# Altium schematic sheet interface2.SchDoc
size A
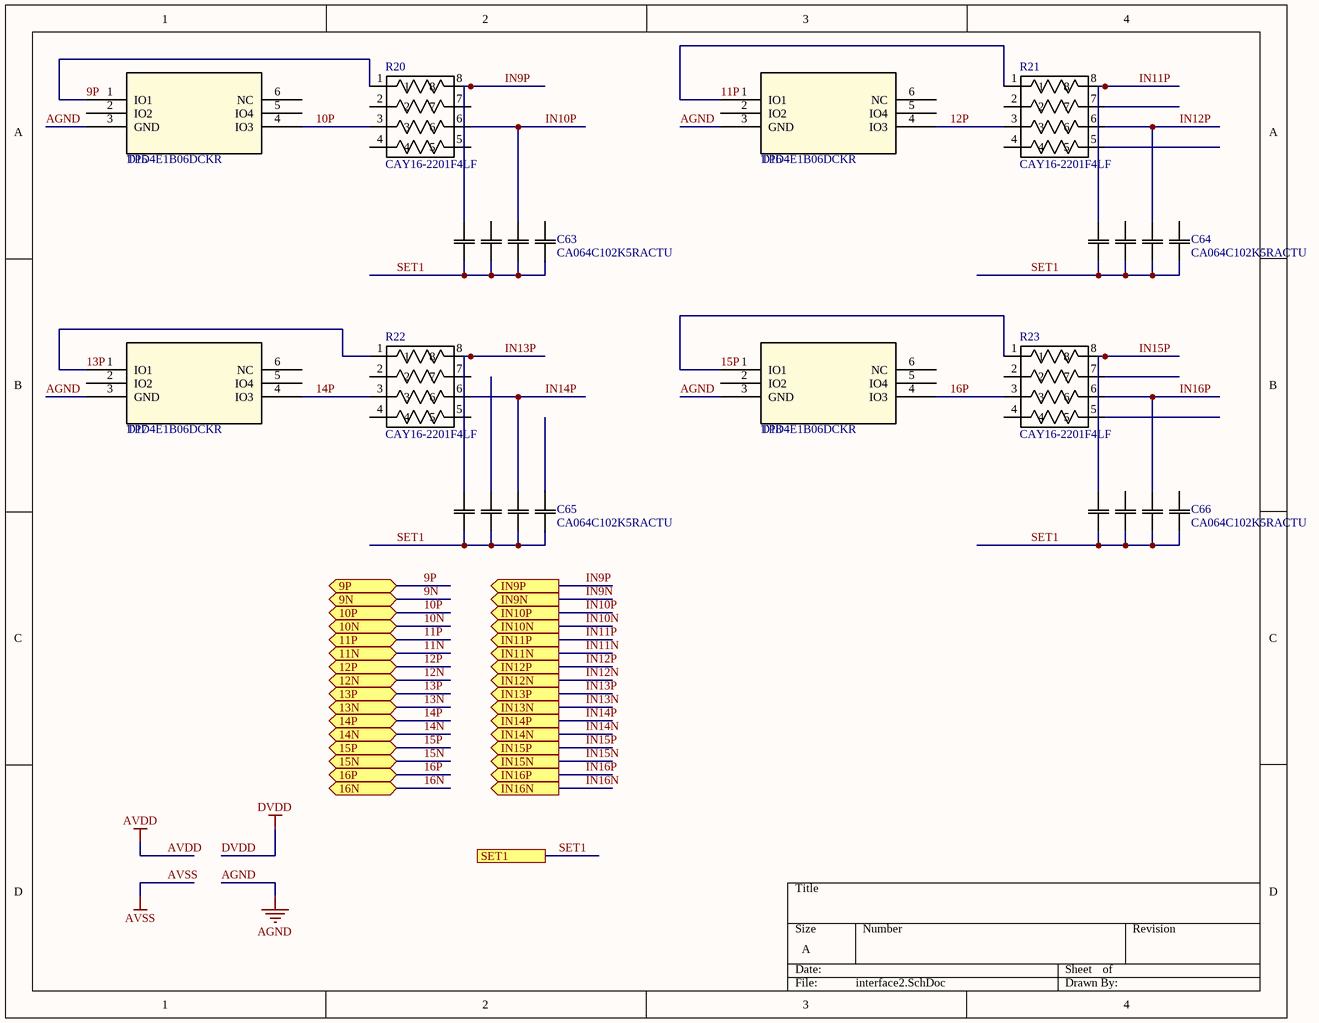
[diagram p0: interface2.SchDoc]

## Parts
C63  CA064C102K5RACTU  [CA064]
C64  CA064C102K5RACTU  [CA064]
C65  CA064C102K5RACTU  [CA064]
C66  CA064C102K5RACTU  [CA064]
D15  TPD4E1B06DCKR  [DCK6]
D16  TPD4E1B06DCKR  [DCK6]
D17  TPD4E1B06DCKR  [DCK6]
D18  TPD4E1B06DCKR  [DCK6]
R20  CAY16-2201F4LF  [*RESCAXE80P320X160-8N]
R21  CAY16-2201F4LF  [*RESCAXE80P320X160-8N]
R22  CAY16-2201F4LF  [*RESCAXE80P320X160-8N]
R23  CAY16-2201F4LF  [*RESCAXE80P320X160-8N]

## Ports
9N (bidir), 9P (bidir), 10N (bidir), 10P (bidir), 11N (bidir), 11P (bidir), 12N (bidir), 12P (bidir), 13N (bidir), 13P (bidir), 14N (bidir), 14P (bidir), 15N (bidir), 15P (bidir), 16N (bidir), 16P (bidir), IN9N (out), IN9P (out), IN10N (out), IN10P (out), IN11N (out), IN11P (out), IN12N (out), IN12P (out), IN13N (out), IN13P (out), IN14N (out), IN14P (out), IN15N (out), IN15P (out), IN16N (out), IN16P (out), SET1

## Nets
AGND: D15.3(GND) D16.3(GND) D17.3(GND) D18.3(GND)
9N: port 9N
9P: D15.1(IO1) R20.1 ; port 9P
10N: port 10N
10P: D15.4(IO3) R20.3 ; port 10P
11N: port 11N
11P: D16.1(IO1) R21.1 ; port 11P
12N: port 12N
12P: D16.4(IO3) R21.3 ; port 12P
13N: port 13N
13P: D17.1(IO1) R22.1 ; port 13P
14N: port 14N
14P: D17.4(IO3) R22.3 ; port 14P
15N: port 15N
15P: D18.1(IO1) R23.1 ; port 15P
16N: port 16N
16P: D18.4(IO3) R23.3 ; port 16P
IN9N: port IN9N
IN9P: C63.8 R20.8 ; port IN9P
IN10N: port IN10N
IN10P: C63.6 R20.6 ; port IN10P
IN11N: port IN11N
IN11P: C64.8 R21.8 ; port IN11P
IN12N: port IN12N
IN12P: C64.6 R21.6 ; port IN12P
IN13N: port IN13N
IN13P: C65.8 R22.8 ; port IN13P
IN14N: port IN14N
IN14P: C65.6 R22.6 ; port IN14P
IN15N: port IN15N
IN15P: C66.8 R23.8 ; port IN15P
IN16N: port IN16N
IN16P: C66.6 R23.6 ; port IN16P
SET1: C63.1 C63.2 C63.3 C63.4 C64.1 C64.2 C64.3 C64.4 C65.1 C65.2 C65.3 C65.4 C66.1 C66.2 C66.3 C66.4 ; port SET1

Not connected (* = marked no-connect by the designer): C63 5 7; C64 5 7; C65 5 7; C66 5 7; D15 2(IO2) 5(IO4) 6(NC); D16 2(IO2) 5(IO4) 6(NC); D17 2(IO2) 5(IO4) 6(NC); D18 2(IO2) 5(IO4) 6(NC); R20 2 4 5 7; R21 2 4 5 7; R22 2 4 5 7; R23 2 4 5 7

## Library data of the parts
C63-C66 = CA064C102K5RACTU: CAP ARRAY 1000PF 50V X7R 0612; Manufacturer 1: KEMET; Dielectric Material: Ceramic; Capacitance: 1nF; Tolerance: 10%; Number of Capacitors: 4; Circuit Type: Isolated; Supplier 1: Digi-Key; Manufacturer Part Number 1: CA064C102K5RACTU; Stock 1: 12; Pricing 1: 1=0.61000, 10=0.42800, 100=0.28180, 500=0.20874, 1000=0.17743 (USD); RoHS: Yes; Mount: Surface Mount; Case/Package: 0612; Case Code (Metric): 1632; Case Code (Imperial): 0612; Contact Plating: Tin,Matte; Number of Terminals: 8; Min Operating Temperature: -55°C; Max Operating Temperature: 125°C; Packaging: Tape and Reel; Package Quantity: 4000; Voltage Rating: 50V; Dielectric: X7R; Termination: SMD/SMT; Number of Elements: 4; Voltage Rating (DC): 50V; Number of Circuits: 4; Length: 0.063inch; Height: 0.8mm; Width: 1.6mm; Height - Seated (Max): 0.035inch; Terminal Pitch: 0.8mm; REACH SVHC: No SVHC; Lead Free: Lead Free; ComponentLink1URL: http://www.farnell.com/datasheets/1868478.pdf?src-supplier=Farnell; ComponentLink1Description: http://www.farnell.com/datasheets/1868478.pdf?src-supplier=Farnell; ComponentLink2URL: https://media.digikey.com/pdf/Data%20Sheets/Kemet%20PDFs/X7R_Dielectric_10-200V_Rev_Nov2013.pdf?src-supplier=Digi-Key; ComponentLink2Description: https://media.digikey.com/pdf/Data%20Sheets/Kemet%20PDFs/X7R_Dielectric_10-200V_Rev_Nov2013.pdf?src-supplier=Digi-Key; ComponentLink3URL: http://www.mouser.com/ds/2/212/KEM_C1017_X7R_ARRAY_SMD-1102778.pdf?src-supplier=Mouser; ComponentLink3Description: http://www.mouser.com/ds/2/212/KEM_C1017_X7R_ARRAY_SMD-1102778.pdf?src-supplier=Mouser; ComponentLink4URL: http://www.farnell.com/datasheets/1868478.pdf?src-supplier=Element14; ComponentLink4Description: http://www.farnell.com/datasheets/1868478.pdf?src-supplier=Element14; ComponentLink5URL: http://capacitoredge.kemet.com/capedge2/DataSheet/Datasheet-CA064C102K5RACTU.pdf?pn=CA064C102K5RACTU&src-supplier=Avnet; ComponentLink5Description: http://capacitoredge.kemet.com/capedge2/DataSheet/Datasheet-CA064C102K5RACTU.pdf?pn=CA064C102K5RACTU&src-supplier=Avnet; ComponentLink6URL: http://capacitoredge.kemet.com/capedge2/DataSheet/Datasheet-CA064C102K5RACTU.pdf?pn=CA064C102K5RACTU&src-supplier=Avnet+Asia; ComponentLink6Description: http://capacitoredge.kemet.com/capedge2/DataSheet/Datasheet-CA064C102K5RACTU.pdf?pn=CA064C102K5RACTU&src-supplier=Avnet+Asia; Supplier Part Number 1: 399-9415-1-ND
D15-D18 = TPD4E1B06DCKR: TVS DIODE 5.5VWM 14.5VC SC70-6; Manufacturer 1: Texas Instruments; Capacitance: 1pF; Operating Supply Voltage: 5.5V; Direction: Bidirectional,Unidirectional; Number of Bidirectional Channels: 4; Min Breakdown Voltage: 7V; Clamping Voltage: 14.5V; Peak Pulse Power: 45W; Power Line Protection: No; Polarity: Bidirectional; ESD Protection: Yes; Max Reverse Leakage Current: 500pA; Test Current: 1mA; Peak Pulse Current: 3A; Interface: LVDS,USB; Supplier 1: Digi-Key; Manufacturer Part Number 1: TPD4E1B06DCKR; Stock 1: 27694; Pricing 1: 1=0.58000, 10=0.49400, 100=0.36920, 500=0.29004, 1000=0.22413 (USD); RoHS: Yes; Mount: Surface Mount; Case/Package: SC; Number of Pins: 6; Min Operating Temperature: -40°C; Max Operating Temperature: 125°C; Package Quantity: 3000; Packaging: Tape and Reel; Reverse Standoff Voltage: 5.5V; Breakdown Voltage: 7V; Number of Channels: 4; Termination: SMD/SMT; Working Voltage: 5.5V; Max Power Dissipation: 45W; Length: 2.15mm; Height: 1mm; Width: 1.4mm; REACH SVHC: No SVHC; Lead Free: Lead Free; ComponentLink1URL: https://datasheet.ciiva.com/12545/tpd4e1b06-224687-12545147.pdf?src-supplier=Mouser; ComponentLink1Description: https://datasheet.ciiva.com/12545/tpd4e1b06-224687-12545147.pdf?src-supplier=Mouser; ComponentLink2URL: https://datasheet.ciiva.com/6574/tpd4e1b06-6574671.pdf?src-supplier=Digi-Key; ComponentLink2Description: https://datasheet.ciiva.com/6574/tpd4e1b06-6574671.pdf?src-supplier=Digi-Key; Supplier Part Number 1: 296-39346-1-ND
R20-R23 = CAY16-2201F4LF: BOURNS         CAY16-2201F4LF             RESISTOR, ARRAY-4, 2.2KOHM, 5%, SMD; Resistance: 2.2kR; Tolerance: 1%; Power Rating: 248mW; Voltage Rating: 50V; Number of Elements: 4; Circuit Type: Isolated; Power Per Element: 62.5mW; Temperature Coefficient: 200ppm/°C; Supplier 1: Digi-Key; Manufacturer 1: Bourns; Manufacturer Part Number 1: CAY16-2201F4LF; Stock 1: 35310; Pricing 1: 1=0.14000, 10=0.12100, 25=0.08800, 50=0.06380, 100=0.04730, 250=0.03632, 500=0.02860, 1000=0.01980 (USD); RoHS: Yes; Mount: Surface Mount; Case/Package: 1206; Number of Pins: 8; Case Code (Metric): 3216; Case Code (Imperial): 1206; Number of Terminals: 8; Contact Plating: Tin; Min Operating Temperature: -55°C; Max Operating Temperature: 125°C; Packaging: Tape and Reel; Package Quantity: 1; Number of Resistors: 4; Termination: Convex; Military Standard: Not; Voltage Rating (DC): 50V; Number of Circuits: 4; Length: 3.2mm; Height: 0.024inch; Width: 0.063inch; Lead Pitch: 0.8mm; Terminal Pitch: 0.8mm; Depth: 1.6mm; REACH SVHC: No SVHC; Lead Free: Lead Free; ComponentLink1URL: https://datasheet.ciiva.com/11807/0900766b8064e462-11807027.pdf?src-supplier=RSComponents; ComponentLink1Description: https://datasheet.ciiva.com/11807/0900766b8064e462-11807027.pdf?src-supplier=RSComponents; ComponentLink2URL: https://datasheet.ciiva.com/16967/catcay-16967355.pdf?src-supplier=Avnet+Europe; ComponentLink2Description: https://datasheet.ciiva.com/16967/catcay-16967355.pdf?src-supplier=Avnet+Europe; ComponentLink3URL: https://datasheet.ciiva.com/6533/catcay-6533677.pdf?src-supplier=Digi-Key; ComponentLink3Description: https://datasheet.ciiva.com/6533/catcay-6533677.pdf?src-supplier=Digi-Key; ComponentLink4URL: https://datasheet.ciiva.com/30021/catcay-30021357.pdf?src-supplier=Avnet; ComponentLink4Description: https://datasheet.ciiva.com/30021/catcay-30021357.pdf?src-supplier=Avnet; ComponentLink5URL: https://datasheet.ciiva.com/1478/1849489-1478846.pdf?src-supplier=Element14; ComponentLink5Description: https://datasheet.ciiva.com/1478/1849489-1478846.pdf?src-supplier=Element14; ComponentLink6URL: https://datasheet.ciiva.com/6533/catcay-6533678.pdf?src-supplier=Digi-Key; ComponentLink6Description: https://datasheet.ciiva.com/6533/catcay-6533678.pdf?src-supplier=Digi-Key; ComponentLink7URL: https://datasheet.ciiva.com/1478/1849489-1478847.pdf?src-supplier=Element14; ComponentLink7Description: https://datasheet.ciiva.com/1478/1849489-1478847.pdf?src-supplier=Element14; ComponentLink8URL: https://datasheet.ciiva.com/6533/catcay-6533679.pdf?src-supplier=Digi-Key; ComponentLink8Description: https://datasheet.ciiva.com/6533/catcay-6533679.pdf?src-supplier=Digi-Key; ComponentLink9URL: https://datasheet.ciiva.com/48692/001055385-da-01-en-wid-arr-cay16-2201f4lf-2-2k-ohm-4-w-1206-48692149.pdf?src-supplier=Conrad; ComponentLink9Description: https://datasheet.ciiva.com/48692/001055385-da-01-en-wid-arr-cay16-2201f4lf-2-2k-ohm-4-w-1206-48692149.pdf?src-supplier=Conrad; Supplier Part Number 1: CAY16-2201F4LFCT-ND